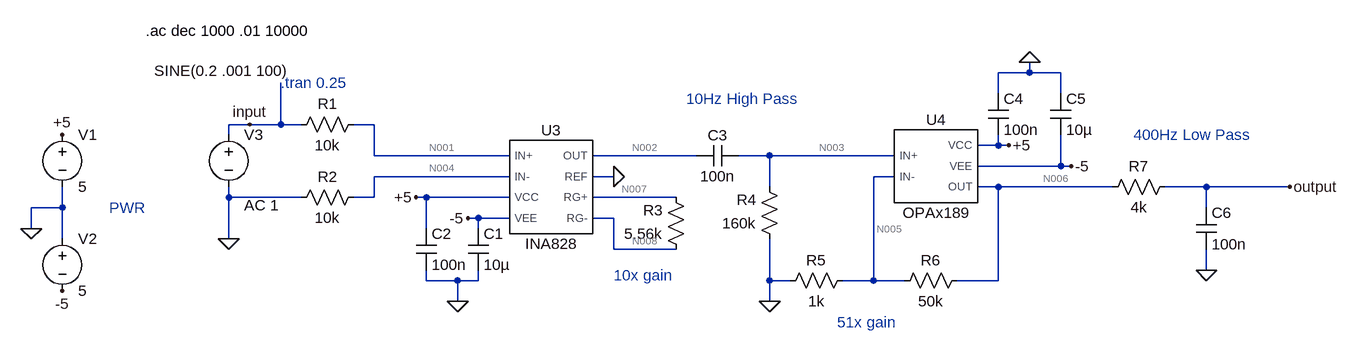
[diagram p0: schematic EMG_BOARD.asc]
EMG_BOARD.asc, the LTspice schematic file:
Version 4.1
SHEET 1 1728 912
WIRE 1232 16 1232 0
WIRE 1232 16 1184 16
WIRE 1280 16 1232 16
WIRE 1184 48 1184 16
WIRE 1280 48 1280 16
WIRE 32 96 0 96
WIRE 80 96 80 32
WIRE 80 96 32 96
WIRE 112 96 80 96
WIRE 224 96 192 96
WIRE 0 112 0 96
WIRE 1184 128 1184 112
WIRE 1184 128 1152 128
WIRE 1200 128 1184 128
WIRE 224 144 224 96
WIRE 432 144 224 144
WIRE 720 144 560 144
WIRE 832 144 784 144
WIRE 1024 144 832 144
WIRE 1280 160 1280 112
WIRE 1280 160 1152 160
WIRE 1296 160 1280 160
WIRE 432 176 224 176
WIRE 592 176 560 176
WIRE 1024 176 992 176
WIRE 832 192 832 144
WIRE 1184 192 1152 192
WIRE 1360 192 1184 192
WIRE 1504 192 1440 192
WIRE 1632 192 1504 192
WIRE 0 208 0 192
WIRE 112 208 0 208
WIRE 224 208 224 176
WIRE 224 208 192 208
WIRE 304 208 288 208
WIRE 432 208 304 208
WIRE 688 208 560 208
WIRE -256 224 -256 192
WIRE -256 224 -304 224
WIRE 1504 224 1504 192
WIRE 384 240 368 240
WIRE 432 240 384 240
WIRE 592 240 560 240
WIRE -304 256 -304 224
WIRE 304 256 304 208
WIRE 384 256 384 240
WIRE -256 272 -256 224
WIRE 0 272 0 208
WIRE 592 288 592 240
WIRE 688 288 592 288
WIRE 1504 320 1504 288
WIRE 304 336 304 320
WIRE 352 336 304 336
WIRE 384 336 384 320
WIRE 384 336 352 336
WIRE 832 336 832 272
WIRE 864 336 832 336
WIRE 992 336 992 176
WIRE 992 336 944 336
WIRE 1040 336 992 336
WIRE 1184 336 1184 192
WIRE 1184 336 1120 336
WIRE 352 368 352 336
WIRE 832 368 832 336
FLAG 592 176 0
FLAG 368 240 -5
FLAG 352 368 0
FLAG 288 208 +5
FLAG 832 368 0
FLAG 1232 0 0
FLAG 1200 128 +5
FLAG 1296 160 -5
FLAG 1504 320 0
FLAG -256 112 +5
FLAG -256 352 -5
FLAG -304 256 0
FLAG 0 272 0
FLAG 1632 192 output
FLAG 32 96 input
SYMBOL res 208 80 R90
WINDOW 0 0 56 VBottom 2
WINDOW 3 32 56 VTop 2
SYMATTR InstName R1
SYMATTR Value 10k
SYMBOL res 208 192 R90
WINDOW 0 0 56 VBottom 2
WINDOW 3 32 56 VTop 2
SYMATTR InstName R2
SYMATTR Value 10k
SYMBOL res 704 304 R180
WINDOW 0 36 76 Left 2
WINDOW 3 36 40 Left 2
SYMATTR InstName R3
SYMATTR Value 5.56k
SYMBOL cap 368 256 R0
SYMATTR InstName C1
SYMATTR Value 10µ
SYMBOL cap 288 256 R0
SYMATTR InstName C2
SYMATTR Value 100n
SYMBOL cap 784 128 R90
WINDOW 0 0 32 VBottom 2
WINDOW 3 32 32 VTop 2
SYMATTR InstName C3
SYMATTR Value 100n
SYMBOL res 848 288 R180
WINDOW 0 36 76 Left 2
WINDOW 3 36 40 Left 2
SYMATTR InstName R4
SYMATTR Value 160k
SYMBOL cap 1168 48 R0
SYMATTR InstName C4
SYMATTR Value 100n
SYMBOL cap 1264 48 R0
SYMATTR InstName C5
SYMATTR Value 10µ
SYMBOL res 960 320 R90
WINDOW 0 0 56 VBottom 2
WINDOW 3 32 56 VTop 2
SYMATTR InstName R5
SYMATTR Value 1k
SYMBOL res 1136 320 R90
WINDOW 0 0 56 VBottom 2
WINDOW 3 32 56 VTop 2
SYMATTR InstName R6
SYMATTR Value 50k
SYMBOL res 1456 176 R90
WINDOW 0 0 56 VBottom 2
WINDOW 3 32 56 VTop 2
SYMATTR InstName R7
SYMATTR Value 4k
SYMBOL cap 1488 224 R0
SYMATTR InstName C6
SYMATTR Value 100n
SYMBOL voltage -256 96 R0
WINDOW 123 0 0 Left 0
WINDOW 39 0 0 Left 0
SYMATTR InstName V1
SYMATTR Value 5
SYMBOL voltage -256 256 R0
WINDOW 123 0 0 Left 0
WINDOW 39 0 0 Left 0
SYMATTR InstName V2
SYMATTR Value 5
SYMBOL voltage 0 96 R0
WINDOW 3 -115 -83 Left 2
WINDOW 123 24 124 Left 2
WINDOW 39 0 0 Left 0
SYMATTR Value SINE(0.2 .001 100)
SYMATTR Value2 AC 1
SYMATTR InstName V3
SYMBOL INA828 496 192 R0
SYMATTR InstName U3
SYMBOL OPAx189 1088 160 R0
SYMATTR InstName U4
TEXT 936 400 Left 2 ;51x gain
TEXT 704 56 Left 2 ;10Hz High Pass
TEXT 1392 112 Left 2 ;400Hz Low Pass
TEXT 592 328 Left 2 ;10x gain
TEXT -184 224 Left 2 ;PWR
TEXT -128 -48 Left 2 !.ac dec 1000 .01 10000
TEXT 80 32 Left 2 ;.tran 0.25

The netlist it stands for:
* EMG_BOARD.asc
R1 N001 input 10k
R2 N004 0 10k
R3 N008 N007 5.56k
C1 -5 0 10µ
C2 +5 0 100n
C3 N003 N002 100n
R4 0 N003 160k
C4 0 +5 100n
C5 0 -5 10µ
R5 N005 0 1k
R6 N006 N005 50k
R7 output N006 4k
C6 output 0 100n
V1 +5 0 5
V2 0 -5 5
V3 input 0 SINE(0.2 .001 100) AC 1
X§U3 N001 N004 +5 -5 N002 0 N007 N008 INA828  ; pins IN+ IN- VCC VEE OUT REF RG+ RG-
X§U4 N003 N005 +5 -5 N006 OPAx189  ; pins IN+ IN- VCC VEE OUT
* 51x gain
* 10Hz High Pass
* 400Hz Low Pass
* 10x gain
* PWR
.ac dec 1000 .01 10000
* .tran 0.25
.lib INA828.LIB
.lib OPAx189.LIB
.backanno
.end

* Results of the author's LTspice run, read from the files saved beside the schematic
* Operating Point, zero values left out:
*   V(+5) = 5 V
*   V(-5) = -5 V
*   V(input) = 200 mV
*   V(n001) = 200 mV
*   V(n002) = 1.999 V
*   V(n003) = -11.2 µV
*   V(n005) = -12.44 µV
*   V(n006) = -638 µV
*   V(n007) = 182 mV
*   V(n008) = -18.04 mV
*   V(output) = -638 µV
*   I(R1) = -151 pA
*   I(R3) = -35.97 µA
*   I(R4) = 70.02 pA
*   I(R5) = -12.44 nA
*   I(R6) = -12.51 nA
*   I(V1) = -1.986 mA
*   I(V2) = -1.972 mA
*   I(V3) = -151 pA
*   Ix(u3:in+) = 151 pA
*   Ix(u3:ref) = -13.52 µA
*   Ix(u3:rg+) = -35.97 µA
*   Ix(u3:rg-) = 35.97 µA
*   Ix(u3:vcc) = 685.9 µA
*   Ix(u3:vee) = -672.4 µA
*   Ix(u4:in+) = 70.02 pA
*   Ix(u4:in-) = -70.02 pA
*   Ix(u4:out) = 12.51 nA
*   Ix(u4:vcc) = 1.3 mA
*   Ix(u4:vee) = -1.3 mA
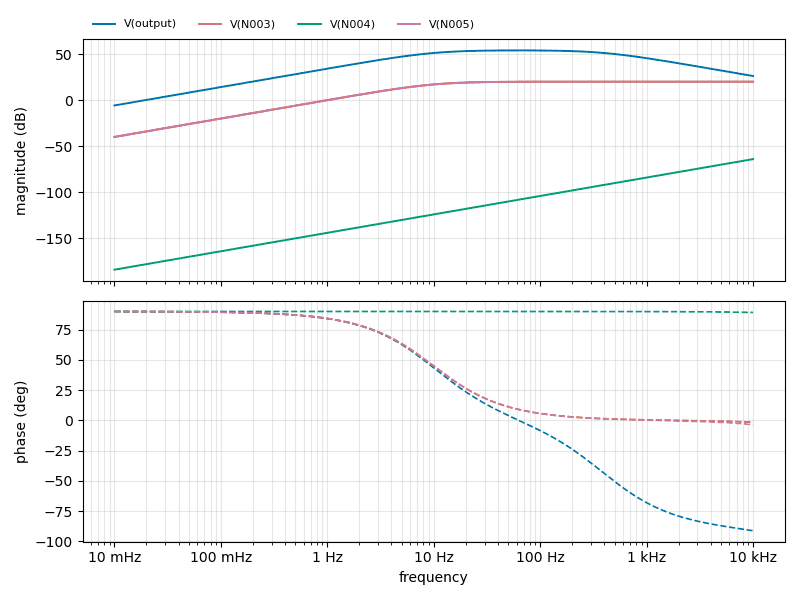
[diagram p1: AC Analysis of EMG_BOARD.asc, plotted from the saved traces]
* AC Analysis, 1 run:
*   V(output): -5.81 dB at 10 mHz, 26.14 dB at 10 kHz, peak 53.93 dB at 62.95 Hz, 3 dB below the peak at 9.484 Hz and 417.3 Hz
*   V(N003): -39.96 dB at 10 mHz, 19.99 dB at 10 kHz, peak 19.99 dB at 8.995 kHz, 3 dB below the peak at 9.947 Hz
*   V(N004): -184.04 dB at 10 mHz, -64.04 dB at 10 kHz, peak -64.04 dB at 10 kHz, 3 dB below the peak at 7.071 kHz
*   V(N005): -39.96 dB at 10 mHz, 20.00 dB at 10 kHz, peak 20.00 dB at 10 kHz, 3 dB below the peak at 9.965 Hz